# EAGLE design Example (EAGLE 8.3.2)
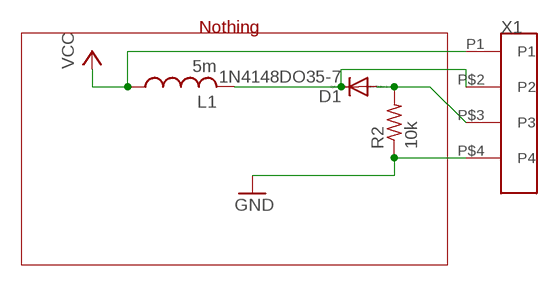
[diagram p0: schematic, sheet 1]

## Parts
D1  1N4148DO35-7  [DO35-7]
L1  5m  L-USL3225P  [L3225P]
R2  10k  R-US_M0805  [M0805]
X1  TE-952  [TE-952]

## Nets
GND: R2.1 X1.P$4(P4)
N$1: D1.C L1.2 X1.P$2(P2)
N$2: D1.A R2.2 X1.P$3(P3)
VCC: L1.1 X1.P1

## Notes on the sheet
- Nothing

## Library data of the parts
D1 = diode:1N4148: DIODE high speed (Philips)
L1 = rcl:L-US: INDUCTOR, American symbol
R2 = rcl:R-US_: RESISTOR, American symbol
X1 = con-tycoelectronics:TE-952

## Board
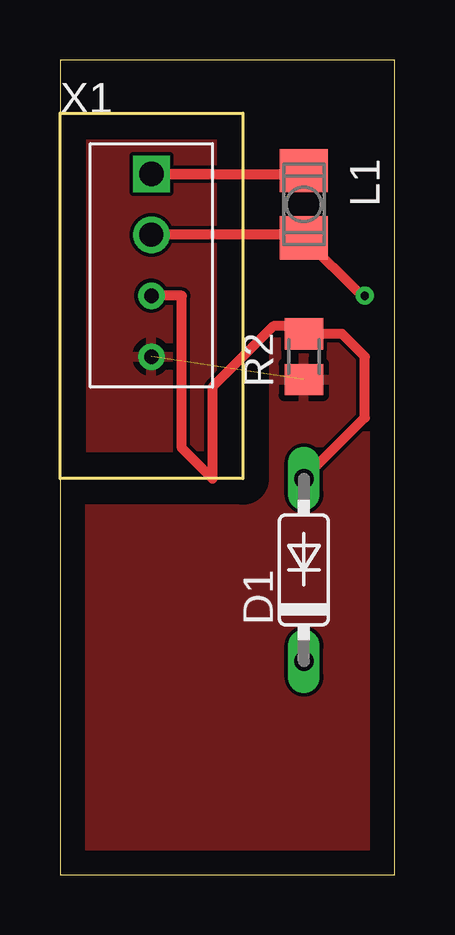
[diagram p1: board, top side]
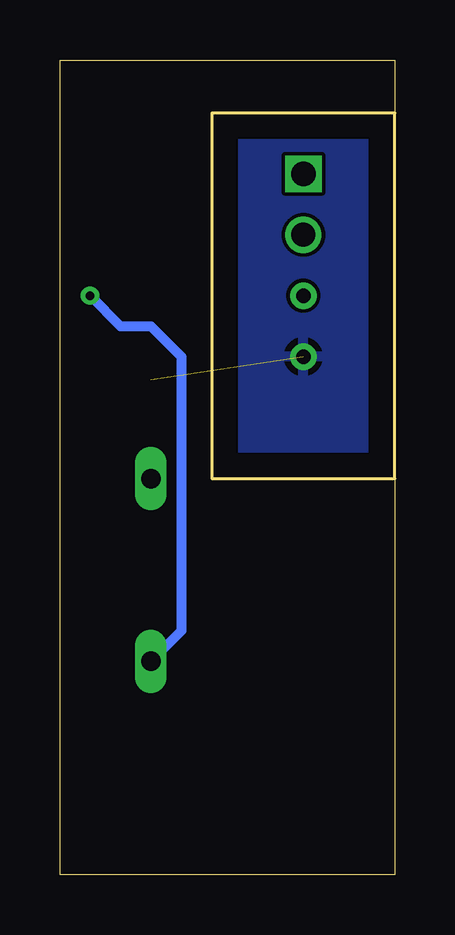
[diagram p2: board, bottom side, seen from below]

Size 13.95 x 33.96 mm. Coordinates in mm from the lower left corner, seen from the top.
Outline: 0,0 13.95,0 13.95,33.96 0,33.96 0,0
Copper layers (1*16): Top 0.035mm / dielectric 1.5mm / Bottom 0.035mm
Design rules "default": minimum track width 6mil, minimum drill 0.35mm, track to track 6mil, track to pad 6mil, pad to pad 6mil, via to via 6mil, smd to smd 6mil, copper to edge 40mil, drill to drill 6mil, minimum pad ring 10mil, minimum via ring 8mil, stop-mask expansion 4mil, vias tented up to drill 0mil, thermal gap 10mil

### Footprints (pad centres in the part's own frame; a part is rotated, then mirrored left to right if it is on the bottom)
DO35-7 = drill 0.813 long: A 3.81,0; C -3.81,0
L3225P = smd 1.8 x 2: 1 -1.4,0; 2 1.4,0
M0805 = smd 1.3 x 1.6: 1 -0.95,0; 2 0.95,0
TE-952 = drill 1.016 square: P1 0,3.81 | drill 1: P$2 0,1.27 | drill 0.6: P$3 0,-1.27; P$4 0,-3.81

### Placement (x,y rotation side)
D1  10.16,12.7 90 top
L1  10.16,27.94 270 top
R2  10.16,21.59 90 top
X1  3.81,25.4 0 top

### Tracks (layer width: path | path; a pad name or v marks a point on that pad's centre or on a via)
GND  (1 unrouted)
  pour Top: 0,0 13.97,0 13.97,34.29 0,34.29
  pour Bottom: 0,0 13.97,0 13.97,34.29 0,34.29
N$1  (via drill 0.35)
  Top 0.406: v12.7,24.13 12.57,24.13 L1.2 10.03,26.67 X1.P$2
  Bottom 0.406: v12.7,24.13 11.43,22.86 10.16,22.86 8.89,21.59 8.89,10.16 D1.C
N$2
  Top 0.406: D1.A 12.7,19.05 12.7,21.59 11.75,22.54 R2.2 9.84,22.86 8.89,22.86 6.35,20.32 6.35,16.51 5.08,17.78 5.08,24.13 X1.P$3
VCC
  Top 0.406: 6.34,29.21 X1.P1 | 6.34,29.21 X1.P1 | X1.P1 6.34,29.21 | X1.P1 10.03,29.21 L1.1